# Altium schematic sheet 04_LMS7002M_Digital.SchDoc: LMS7002M #1 digital circuit
size A3; Organization: Lime Microsystems; Address1: Surrey Tech Centre; Address2: Guildford GU2 7YG; Address3: Surrey; Address4: United Kingdom; Revision: v1.2; SheetNumber: 4; SheetTotal: 27
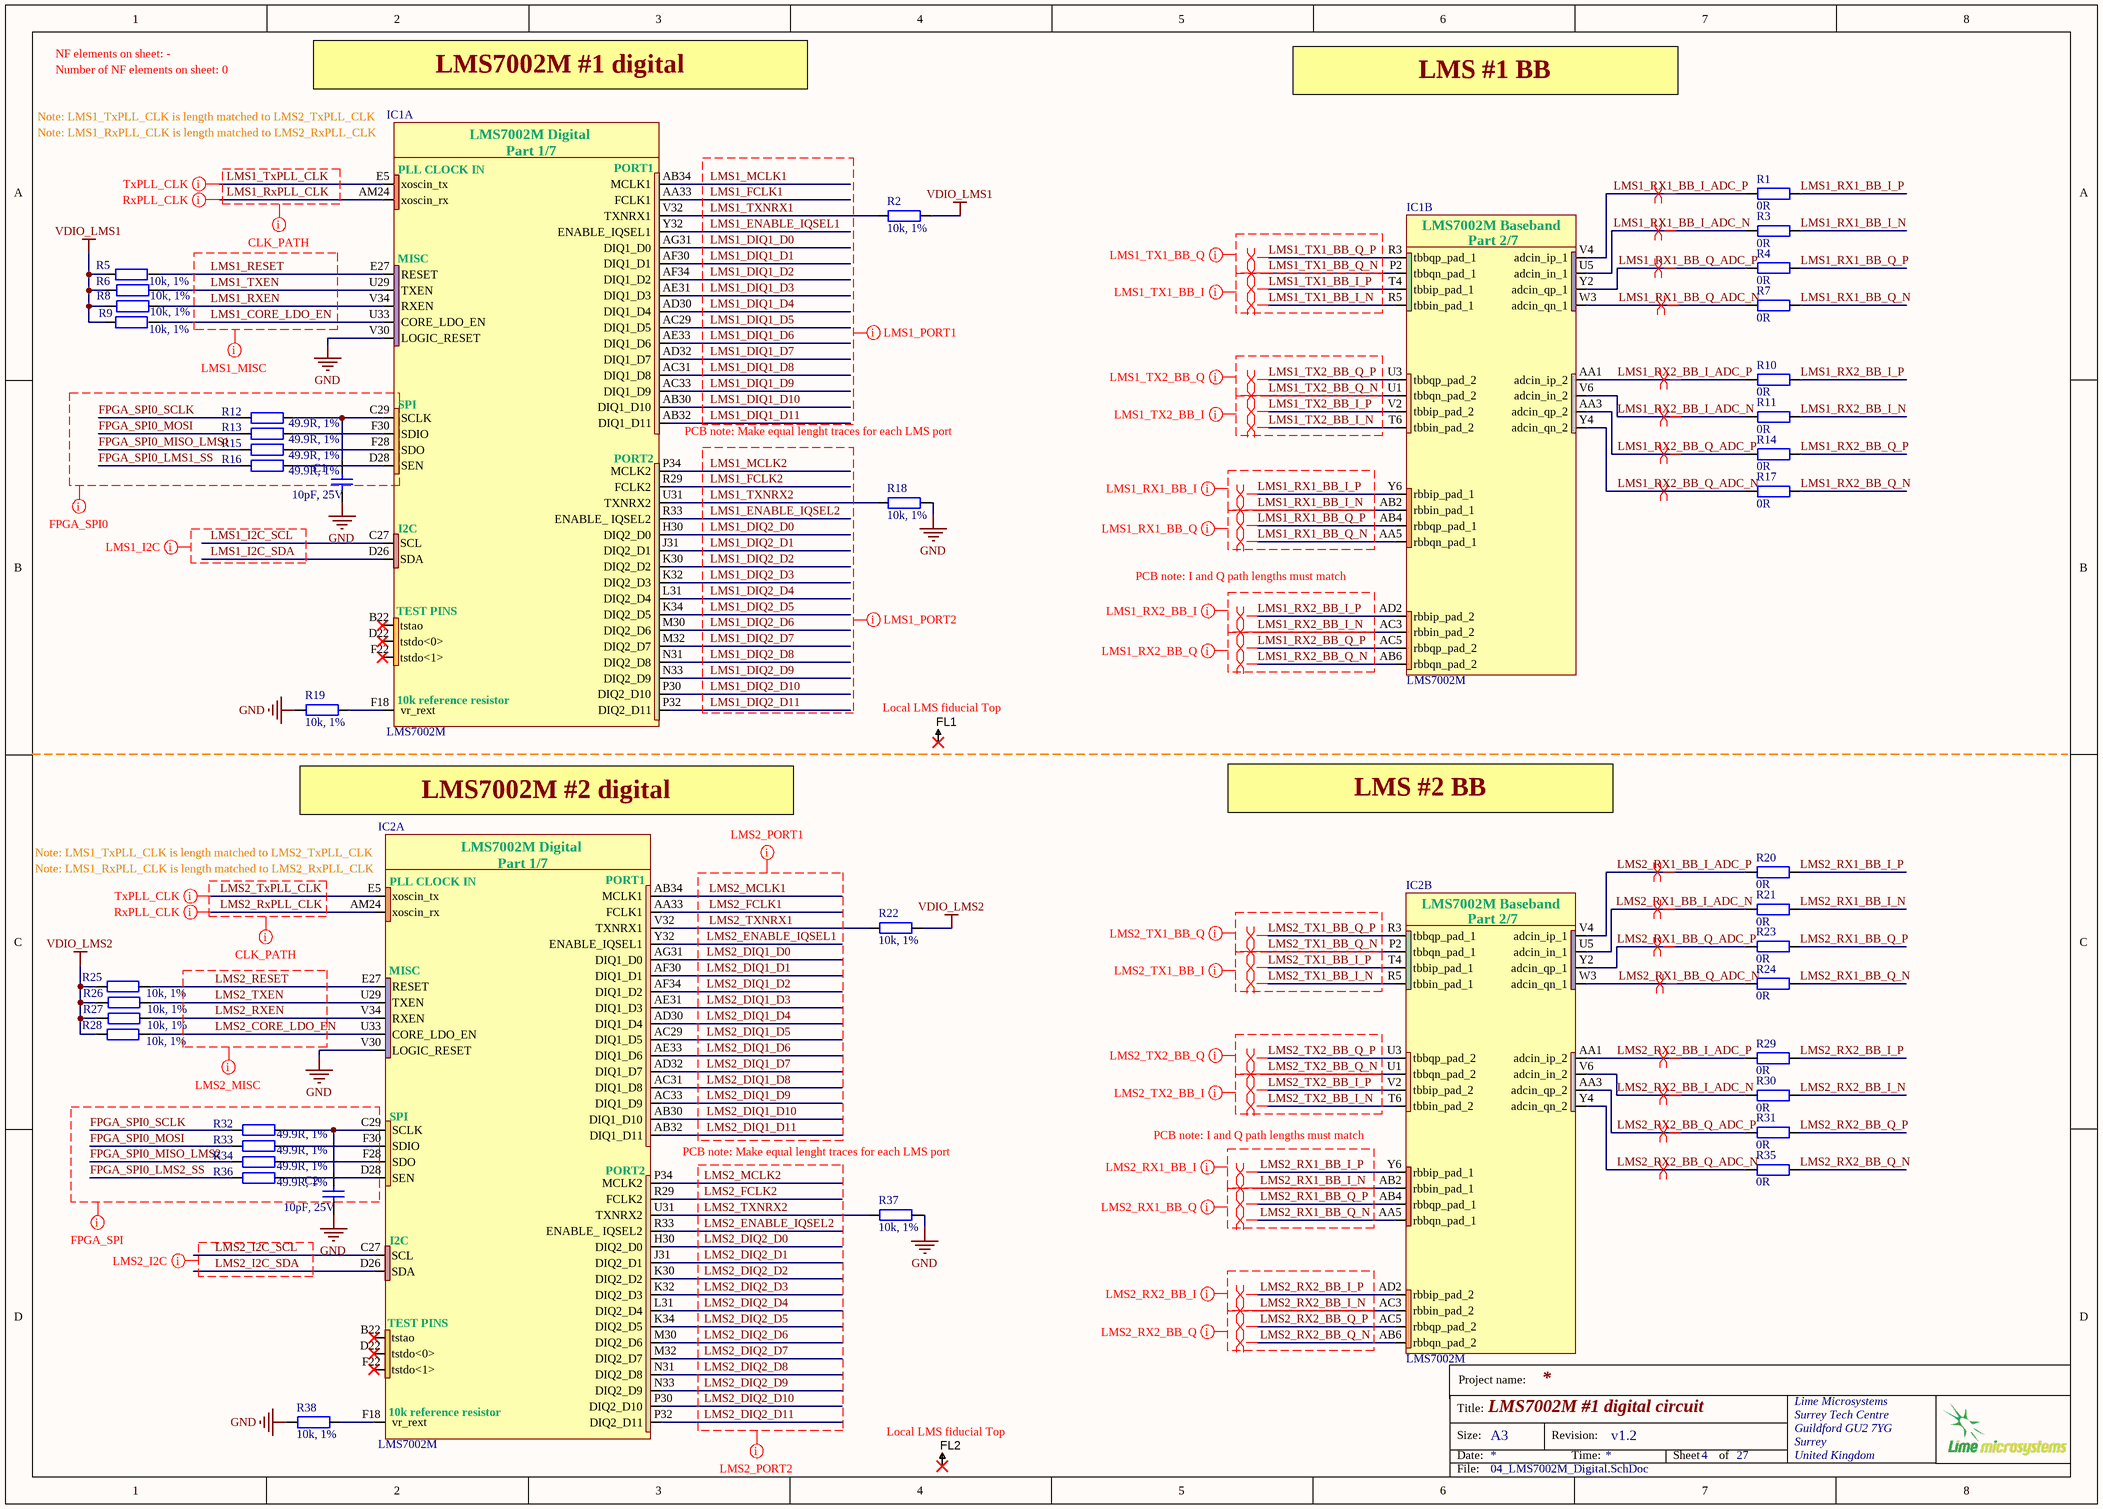
[diagram p0: 04_LMS7002M_Digital.SchDoc]

## Parts
C1  10pF, 25V  [CAP0402]
C2  10pF, 25V  [CAP0402]
FL1  Fiducial  [Fiducial_local]  (value not drawn)
FL2  Fiducial  [Fiducial_local]  (value not drawn)
IC1  LMS7002M  [LMS7002M_v4]  (parts A,B of 7)
IC2  LMS7002M  [LMS7002M_v4]  (parts A,B of 7)
R1  0R  [RES0402]
R2  10k, 1%  [RES0402]
R3  0R  [RES0402]
R4  0R  [RES0402]
R5  10k, 1%  [RES0402]
R6  10k, 1%  [RES0402]
R7  0R  [RES0402]
R8  10k, 1%  [RES0402]
R9  10k, 1%  [RES0402]
R10  0R  [RES0402]
R11  0R  [RES0402]
R12  49.9R, 1%  [RES0402]
R13  49.9R, 1%  [RES0402]
R14  0R  [RES0402]
R15  49.9R, 1%  [RES0402]
R16  49.9R, 1%  [RES0402]
R17  0R  [RES0402]
R18  10k, 1%  [RES0402]
R19  10k, 1%  [RES0402]
R20  0R  [RES0402]
R21  0R  [RES0402]
R22  10k, 1%  [RES0402]
R23  0R  [RES0402]
R24  0R  [RES0402]
R25  10k, 1%  [RES0402]
R26  10k, 1%  [RES0402]
R27  10k, 1%  [RES0402]
R28  10k, 1%  [RES0402]
R29  0R  [RES0402]
R30  0R  [RES0402]
R31  0R  [RES0402]
R32  49.9R, 1%  [RES0402]
R33  49.9R, 1%  [RES0402]
R34  49.9R, 1%  [RES0402]
R35  0R  [RES0402]
R36  49.9R, 1%  [RES0402]
R37  10k, 1%  [RES0402]
R38  10k, 1%  [RES0402]

## Nets
GND: C1.2 C2.2 IC1.V30(LOGIC_RESET) IC2.V30(LOGIC_RESET) R18.2 R19.2 R37.2 R38.2
VDIO_LMS1: R2.2 R5.1 R6.2 R8.2 R9.1
VDIO_LMS2: R22.2 R25.1 R26.2 R27.2 R28.1
FPGA_SPI0_LMS1_SS: R16.2
FPGA_SPI0_LMS2_SS: R36.2
FPGA_SPI0_MISO_LMS1: R15.2
FPGA_SPI0_MISO_LMS2: R34.2
FPGA_SPI0_MOSI: R13.2 R33.2
FPGA_SPI0_SCLK: R12.2 R32.2
LMS1_CORE_LDO_EN: IC1.U33(CORE_LDO_EN) R9.2
LMS1_DIQ1_D0: IC1.AG31(DIQ1_D0)
LMS1_DIQ1_D1: IC1.AF30(DIQ1_D1)
LMS1_DIQ1_D2: IC1.AF34(DIQ1_D2)
LMS1_DIQ1_D3: IC1.AE31(DIQ1_D3)
LMS1_DIQ1_D4: IC1.AD30(DIQ1_D4)
LMS1_DIQ1_D5: IC1.AC29(DIQ1_D5)
LMS1_DIQ1_D6: IC1.AE33(DIQ1_D6)
LMS1_DIQ1_D7: IC1.AD32(DIQ1_D7)
LMS1_DIQ1_D8: IC1.AC31(DIQ1_D8)
LMS1_DIQ1_D9: IC1.AC33(DIQ1_D9)
LMS1_DIQ1_D10: IC1.AB30(DIQ1_D10)
LMS1_DIQ1_D11: IC1.AB32(DIQ1_D11)
LMS1_DIQ2_D0: IC1.H30(DIQ2_D0)
LMS1_DIQ2_D1: IC1.J31(DIQ2_D1)
LMS1_DIQ2_D2: IC1.K30(DIQ2_D2)
LMS1_DIQ2_D3: IC1.K32(DIQ2_D3)
LMS1_DIQ2_D4: IC1.L31(DIQ2_D4)
LMS1_DIQ2_D5: IC1.K34(DIQ2_D5)
LMS1_DIQ2_D6: IC1.M30(DIQ2_D6)
LMS1_DIQ2_D7: IC1.M32(DIQ2_D7)
LMS1_DIQ2_D8: IC1.N31(DIQ2_D8)
LMS1_DIQ2_D9: IC1.N33(DIQ2_D9)
LMS1_DIQ2_D10: IC1.P30(DIQ2_D10)
LMS1_DIQ2_D11: IC1.P32(DIQ2_D11)
LMS1_ENABLE_IQSEL1: IC1.Y32(ENABLE_IQSEL1)
LMS1_ENABLE_IQSEL2: IC1.R33(ENABLE__IQSEL2)
LMS1_FCLK1: IC1.AA33(FCLK1)
LMS1_FCLK2: IC1.R29(FCLK2)
LMS1_I2C_SCL: IC1.C27(SCL)
LMS1_I2C_SDA: IC1.D26(SDA)
LMS1_MCLK1: IC1.AB34(MCLK1)
LMS1_MCLK2: IC1.P34(MCLK2)
LMS1_RESET: IC1.E27(RESET) R5.2
LMS1_RX1_BB_I_ADC_N: IC1.U5(adcin_in_1) R3.2
LMS1_RX1_BB_I_ADC_P: IC1.V4(adcin_ip_1) R1.2
LMS1_RX1_BB_I_N: IC1.AB2(rbbin_pad_1) R3.1
LMS1_RX1_BB_I_P: IC1.Y6(rbbip_pad_1) R1.1
LMS1_RX1_BB_Q_ADC_N: IC1.W3(adcin_qn_1) R7.2
LMS1_RX1_BB_Q_ADC_P: IC1.Y2(adcin_qp_1) R4.2
LMS1_RX1_BB_Q_N: IC1.AA5(rbbqn_pad_1) R7.1
LMS1_RX1_BB_Q_P: IC1.AB4(rbbqp_pad_1) R4.1
LMS1_RX2_BB_I_ADC_N: IC1.V6(adcin_in_2) R11.2
LMS1_RX2_BB_I_ADC_P: IC1.AA1(adcin_ip_2) R10.2
LMS1_RX2_BB_I_N: IC1.AC3(rbbin_pad_2) R11.1
LMS1_RX2_BB_I_P: IC1.AD2(rbbip_pad_2) R10.1
LMS1_RX2_BB_Q_ADC_N: IC1.Y4(adcin_qn_2) R17.2
LMS1_RX2_BB_Q_ADC_P: IC1.AA3(adcin_qp_2) R14.2
LMS1_RX2_BB_Q_N: IC1.AB6(rbbqn_pad_2) R17.1
LMS1_RX2_BB_Q_P: IC1.AC5(rbbqp_pad_2) R14.1
LMS1_RXEN: IC1.V34(RXEN) R6.1
LMS1_RxPLL_CLK: IC1.AM24(xoscin_rx)
LMS1_TX1_BB_I_N: IC1.R5(tbbin_pad_1)
LMS1_TX1_BB_I_P: IC1.T4(tbbip_pad_1)
LMS1_TX1_BB_Q_N: IC1.P2(tbbqn_pad_1)
LMS1_TX1_BB_Q_P: IC1.R3(tbbqp_pad_1)
LMS1_TX2_BB_I_N: IC1.T6(tbbin_pad_2)
LMS1_TX2_BB_I_P: IC1.V2(tbbip_pad_2)
LMS1_TX2_BB_Q_N: IC1.U1(tbbqn_pad_2)
LMS1_TX2_BB_Q_P: IC1.U3(tbbqp_pad_2)
LMS1_TXEN: IC1.U29(TXEN) R8.1
LMS1_TXNRX1: IC1.V32(TXNRX1) R2.1
LMS1_TXNRX2: IC1.U31(TXNRX2) R18.1
LMS1_TxPLL_CLK: IC1.E5(xoscin_tx)
LMS2_CORE_LDO_EN: IC2.U33(CORE_LDO_EN) R28.2
LMS2_DIQ1_D0: IC2.AG31(DIQ1_D0)
LMS2_DIQ1_D1: IC2.AF30(DIQ1_D1)
LMS2_DIQ1_D2: IC2.AF34(DIQ1_D2)
LMS2_DIQ1_D3: IC2.AE31(DIQ1_D3)
LMS2_DIQ1_D4: IC2.AD30(DIQ1_D4)
LMS2_DIQ1_D5: IC2.AC29(DIQ1_D5)
LMS2_DIQ1_D6: IC2.AE33(DIQ1_D6)
LMS2_DIQ1_D7: IC2.AD32(DIQ1_D7)
LMS2_DIQ1_D8: IC2.AC31(DIQ1_D8)
LMS2_DIQ1_D9: IC2.AC33(DIQ1_D9)
LMS2_DIQ1_D10: IC2.AB30(DIQ1_D10)
LMS2_DIQ1_D11: IC2.AB32(DIQ1_D11)
LMS2_DIQ2_D0: IC2.H30(DIQ2_D0)
LMS2_DIQ2_D1: IC2.J31(DIQ2_D1)
LMS2_DIQ2_D2: IC2.K30(DIQ2_D2)
LMS2_DIQ2_D3: IC2.K32(DIQ2_D3)
LMS2_DIQ2_D4: IC2.L31(DIQ2_D4)
LMS2_DIQ2_D5: IC2.K34(DIQ2_D5)
LMS2_DIQ2_D6: IC2.M30(DIQ2_D6)
LMS2_DIQ2_D7: IC2.M32(DIQ2_D7)
LMS2_DIQ2_D8: IC2.N31(DIQ2_D8)
LMS2_DIQ2_D9: IC2.N33(DIQ2_D9)
LMS2_DIQ2_D10: IC2.P30(DIQ2_D10)
LMS2_DIQ2_D11: IC2.P32(DIQ2_D11)
LMS2_ENABLE_IQSEL1: IC2.Y32(ENABLE_IQSEL1)
LMS2_ENABLE_IQSEL2: IC2.R33(ENABLE__IQSEL2)
LMS2_FCLK1: IC2.AA33(FCLK1)
LMS2_FCLK2: IC2.R29(FCLK2)
LMS2_I2C_SCL: IC2.C27(SCL)
LMS2_I2C_SDA: IC2.D26(SDA)
LMS2_MCLK1: IC2.AB34(MCLK1)
LMS2_MCLK2: IC2.P34(MCLK2)
LMS2_RESET: IC2.E27(RESET) R25.2
LMS2_RX1_BB_I_ADC_N: IC2.U5(adcin_in_1) R21.2
LMS2_RX1_BB_I_ADC_P: IC2.V4(adcin_ip_1) R20.2
LMS2_RX1_BB_I_N: IC2.AB2(rbbin_pad_1) R21.1
LMS2_RX1_BB_I_P: IC2.Y6(rbbip_pad_1) R20.1
LMS2_RX1_BB_Q_ADC_N: IC2.W3(adcin_qn_1) R24.2
LMS2_RX1_BB_Q_ADC_P: IC2.Y2(adcin_qp_1) R23.2
LMS2_RX1_BB_Q_N: IC2.AA5(rbbqn_pad_1) R24.1
LMS2_RX1_BB_Q_P: IC2.AB4(rbbqp_pad_1) R23.1
LMS2_RX2_BB_I_ADC_N: IC2.V6(adcin_in_2) R30.2
LMS2_RX2_BB_I_ADC_P: IC2.AA1(adcin_ip_2) R29.2
LMS2_RX2_BB_I_N: IC2.AC3(rbbin_pad_2) R30.1
LMS2_RX2_BB_I_P: IC2.AD2(rbbip_pad_2) R29.1
LMS2_RX2_BB_Q_ADC_N: IC2.Y4(adcin_qn_2) R35.2
LMS2_RX2_BB_Q_ADC_P: IC2.AA3(adcin_qp_2) R31.2
LMS2_RX2_BB_Q_N: IC2.AB6(rbbqn_pad_2) R35.1
LMS2_RX2_BB_Q_P: IC2.AC5(rbbqp_pad_2) R31.1
LMS2_RXEN: IC2.V34(RXEN) R27.1
LMS2_RxPLL_CLK: IC2.AM24(xoscin_rx)
LMS2_TX1_BB_I_N: IC2.R5(tbbin_pad_1)
LMS2_TX1_BB_I_P: IC2.T4(tbbip_pad_1)
LMS2_TX1_BB_Q_N: IC2.P2(tbbqn_pad_1)
LMS2_TX1_BB_Q_P: IC2.R3(tbbqp_pad_1)
LMS2_TX2_BB_I_N: IC2.T6(tbbin_pad_2)
LMS2_TX2_BB_I_P: IC2.V2(tbbip_pad_2)
LMS2_TX2_BB_Q_N: IC2.U1(tbbqn_pad_2)
LMS2_TX2_BB_Q_P: IC2.U3(tbbqp_pad_2)
LMS2_TXEN: IC2.U29(TXEN) R26.1
LMS2_TXNRX1: IC2.V32(TXNRX1) R22.1
LMS2_TXNRX2: IC2.U31(TXNRX2) R37.1
LMS2_TxPLL_CLK: IC2.E5(xoscin_tx)
NetC1_1: C1.1 IC1.C29(SCLK) R12.1
NetC2_1: C2.1 IC2.C29(SCLK) R32.1
NetIC1_D28: IC1.D28(SEN) R16.1
NetIC1_F18: IC1.F18(vr_rext) R19.1
NetIC1_F28: IC1.F28(SDO) R15.1
NetIC1_F30: IC1.F30(SDIO) R13.1
NetIC2_D28: IC2.D28(SEN) R36.1
NetIC2_F18: IC2.F18(vr_rext) R38.1
NetIC2_F28: IC2.F28(SDO) R34.1
NetIC2_F30: IC2.F30(SDIO) R33.1

Not connected (* = marked no-connect by the designer): FL1 1*; FL2 1*; IC1 B22(tstao)* D22(tstdo<0>)* F22(tstdo<1>)*; IC2 B22(tstao)* D22(tstdo<0>)* F22(tstdo<1>)*

## Layout directives
differential pair: LMS1_RX1_BB_I_ADC_N, LMS1_RX1_BB_I_ADC_P, LMS1_RX1_BB_I_N, LMS1_RX1_BB_I_P, LMS1_RX1_BB_Q_ADC_N, LMS1_RX1_BB_Q_ADC_P, LMS1_RX1_BB_Q_N, LMS1_RX1_BB_Q_P, LMS1_RX2_BB_I_ADC_N, LMS1_RX2_BB_I_ADC_P, LMS1_RX2_BB_I_N, LMS1_RX2_BB_I_P, LMS1_RX2_BB_Q_ADC_N, LMS1_RX2_BB_Q_ADC_P, LMS1_RX2_BB_Q_N, LMS1_RX2_BB_Q_P, LMS1_TX1_BB_I_N, LMS1_TX1_BB_I_P, LMS1_TX1_BB_Q_N, LMS1_TX1_BB_Q_P, LMS1_TX2_BB_I_N, LMS1_TX2_BB_I_P, LMS1_TX2_BB_Q_N, LMS1_TX2_BB_Q_P, LMS2_RX1_BB_I_ADC_N, LMS2_RX1_BB_I_ADC_P, LMS2_RX1_BB_I_N, LMS2_RX1_BB_I_P, LMS2_RX1_BB_Q_ADC_N, LMS2_RX1_BB_Q_ADC_P, LMS2_RX1_BB_Q_N, LMS2_RX1_BB_Q_P, LMS2_RX2_BB_I_ADC_N, LMS2_RX2_BB_I_ADC_P, LMS2_RX2_BB_I_N, LMS2_RX2_BB_I_P, LMS2_RX2_BB_Q_ADC_N, LMS2_RX2_BB_Q_ADC_P, LMS2_RX2_BB_Q_N, LMS2_RX2_BB_Q_P, LMS2_TX1_BB_I_N, LMS2_TX1_BB_I_P, LMS2_TX1_BB_Q_N, LMS2_TX1_BB_Q_P, LMS2_TX2_BB_I_N, LMS2_TX2_BB_I_P, LMS2_TX2_BB_Q_N, LMS2_TX2_BB_Q_P
net class LMS1_RX1_BB_I: LMS1_RX1_BB_I_N, LMS1_RX1_BB_I_P
net class LMS1_RX1_BB_Q: LMS1_RX1_BB_I_N, LMS1_RX1_BB_Q_N, LMS1_RX1_BB_Q_P
net class LMS1_TX1_BB_Q: LMS1_TX1_BB_Q_N, LMS1_TX1_BB_Q_P
net class LMS1_TX1_BB_I: LMS1_TX1_BB_I_N, LMS1_TX1_BB_I_P, LMS1_TX1_BB_Q_N
net class LMS1_TX2_BB_Q: LMS1_TX2_BB_Q_N, LMS1_TX2_BB_Q_P
net class LMS1_TX2_BB_I: LMS1_TX2_BB_I_N, LMS1_TX2_BB_I_P, LMS1_TX2_BB_Q_N
net class FPGA_SPI0: FPGA_SPI0_LMS1_SS, FPGA_SPI0_MISO_LMS1, FPGA_SPI0_MOSI, FPGA_SPI0_SCLK
net class LMS1_I2C: LMS1_I2C_SCL, LMS1_I2C_SDA
net class LMS1_PORT2: LMS1_DIQ2_D0, LMS1_DIQ2_D1, LMS1_DIQ2_D2, LMS1_DIQ2_D3, LMS1_DIQ2_D4, LMS1_DIQ2_D5, LMS1_DIQ2_D6, LMS1_DIQ2_D7, LMS1_DIQ2_D8, LMS1_DIQ2_D9, LMS1_DIQ2_D10, LMS1_DIQ2_D11, LMS1_ENABLE_IQSEL2, LMS1_FCLK2, LMS1_MCLK2, LMS1_TXNRX2
net class LMS1_PORT1: LMS1_DIQ1_D0, LMS1_DIQ1_D1, LMS1_DIQ1_D2, LMS1_DIQ1_D3, LMS1_DIQ1_D4, LMS1_DIQ1_D5, LMS1_DIQ1_D6, LMS1_DIQ1_D7, LMS1_DIQ1_D8, LMS1_DIQ1_D9, LMS1_DIQ1_D10, LMS1_DIQ1_D11, LMS1_ENABLE_IQSEL1, LMS1_FCLK1, LMS1_MCLK1, LMS1_TXNRX1
net class LMS1_MISC: LMS1_CORE_LDO_EN, LMS1_RESET, LMS1_RXEN, LMS1_TXEN
net class CLK_PATH: LMS1_RxPLL_CLK, LMS1_TxPLL_CLK, LMS2_RxPLL_CLK, LMS2_TxPLL_CLK
net class FPGA_SPI: FPGA_SPI0_LMS2_SS, FPGA_SPI0_MISO_LMS2, FPGA_SPI0_MOSI, FPGA_SPI0_SCLK
net class LMS2_I2C: LMS2_I2C_SCL, LMS2_I2C_SDA
net class LMS2_PORT2: LMS2_DIQ2_D0, LMS2_DIQ2_D1, LMS2_DIQ2_D2, LMS2_DIQ2_D3, LMS2_DIQ2_D4, LMS2_DIQ2_D5, LMS2_DIQ2_D6, LMS2_DIQ2_D7, LMS2_DIQ2_D8, LMS2_DIQ2_D9, LMS2_DIQ2_D10, LMS2_DIQ2_D11, LMS2_ENABLE_IQSEL2, LMS2_FCLK2, LMS2_MCLK2, LMS2_TXNRX2
net class LMS2_PORT1: LMS2_DIQ1_D0, LMS2_DIQ1_D1, LMS2_DIQ1_D2, LMS2_DIQ1_D3, LMS2_DIQ1_D4, LMS2_DIQ1_D5, LMS2_DIQ1_D6, LMS2_DIQ1_D7, LMS2_DIQ1_D8, LMS2_DIQ1_D9, LMS2_DIQ1_D10, LMS2_DIQ1_D11, LMS2_ENABLE_IQSEL1, LMS2_FCLK1, LMS2_MCLK1, LMS2_TXNRX1
net class LMS2_TX1_BB_Q: LMS2_TX1_BB_Q_N, LMS2_TX1_BB_Q_P
net class LMS2_TX1_BB_I: LMS2_TX1_BB_I_N, LMS2_TX1_BB_I_P, LMS2_TX1_BB_Q_N
net class LMS2_TX2_BB_Q: LMS2_TX2_BB_Q_N, LMS2_TX2_BB_Q_P
net class LMS2_TX2_BB_I: LMS2_TX2_BB_I_N, LMS2_TX2_BB_I_P, LMS2_TX2_BB_Q_N
net class LMS2_MISC: LMS2_CORE_LDO_EN, LMS2_RESET, LMS2_RXEN, LMS2_TXEN
net class LMS2_RX1_BB_I: LMS2_RX1_BB_I_N, LMS2_RX1_BB_I_P
net class LMS2_RX1_BB_Q: LMS2_RX1_BB_I_N, LMS2_RX1_BB_Q_N, LMS2_RX1_BB_Q_P
net class LMS2_RX2_BB_I: LMS2_RX2_BB_I_P
net class LMS2_RX2_BB_Q: LMS2_RX2_BB_I_N, LMS2_RX2_BB_Q_N, LMS2_RX2_BB_Q_P
net class LMS1_RX2_BB_I: LMS1_RX2_BB_I_N, LMS1_RX2_BB_I_P
net class LMS1_RX2_BB_Q: LMS1_RX2_BB_I_N, LMS1_RX2_BB_Q_N, LMS1_RX2_BB_Q_P
net class RxPLL_CLK: LMS1_RxPLL_CLK, LMS2_RxPLL_CLK
net class TxPLL_CLK: LMS1_TxPLL_CLK, LMS2_TxPLL_CLK

## Notes on the sheet
- NF elements on sheet: -
- Number of NF elements on sheet: 0
- LMS7002M #1 digital
- LMS #1 BB
- Note: LMS1_TxPLL_CLK is length matched to LMS2_TxPLL_CLK
- (near IC1) Note: LMS1_RxPLL_CLK is length matched to LMS2_RxPLL_CLK
- (near IC1) PCB note: Make equal lenght traces for each LMS port
- (near IC1) PCB note: I and Q path lengths must match
- (near FL1) Local LMS fiducial Top
- (near IC2) Note: LMS1_TxPLL_CLK is length matched to LMS2_TxPLL_CLK
- LMS7002M #2 digital
- LMS #2 BB
- (near IC2) Note: LMS1_RxPLL_CLK is length matched to LMS2_RxPLL_CLK
- (near IC2) PCB note: Make equal lenght traces for each LMS port
- (near IC2) PCB note: I and Q path lengths must match
- (near FL2) Local LMS fiducial Top
- Project name:
- Title:
- Size:
- Date:
- A3
- Revision:
- Time:
- Sheet
- of
- File:
- (in symbol LMS7002Mr3, part A) LMS7002M Digital; Part 1/7; PLL CLOCK IN; PORT1; MISC; SPI; PORT2; I2C; TEST PINS; 10k reference resistor
- (in symbol LMS7002Mr3, part B) LMS7002M Baseband; Part 2/7

## Library data of the parts
C1 C2 = Cap_0402: Manufacturer Part Number 1: 04023A100JAT2A; Manufacturer: AVX; Part Description: 10pF ±5% 25V Ceramic Capacitor C0G, NP0 0402 (1005 Metric); Capacitance Tolerance: ± 5%; Voltage Rating: 25; Ceramic Capacitor Case: 0402 [1005 Metric]; Capacitor Case Style: 0402 [1005 Metric]<!--FANDB--><div class="features-and-benefits-container"></div>; Dielectric Characteristic: C0G / NP0; SVHC: No SVHC (16-Jun-2014); Capacitance: 10; Value: 10pF, 25V; Supplier 1: Farnell; Supplier Part Number 1: 2332478RL; Product Range: -; RoHS: YES; Operating Temperature Min: -55; Operating Temperature Max: 125; Capacitance Tolerance ±: ± 5%; MSL: MSL 1 - Unlimited; Packaging: Cut Tape
IC1 IC2 = LMS7002Mr3: Schematic symbol revision 3. Default footprint - 0.31mm pad; Manufacturer: Lime Microsystems; Part Description: IC FPRF Transceiver LMS7002M; 261 pin aQFN; Supplier 1: Lime Microsystems; Supplier Part Number 1: LMS7002M; Manufacturer Part Number 1: LMS7002M
R1 R3 R4 R7 R10 R11 R14 R17 R20 R21 R23 R24 R29-R31 R35 = Res_0402: Manufacturer Part Number 1: RC0402JR-070RL; Manufacturer: Yageo; Part Description: RES SMD 0.0OHM JUMPER 1/16W 0402; Resistance (Ohms): 0.0; Tolerance: Jumper; Power (Watts): 0.063W, 1/16W; Value: 0R; Supplier 1: Digi-Key; Supplier Part Number 1: 311-0.0JRTR-ND; Category: Resistors; Temperature Coefficient: -; Features: Moisture Resistant; Supplier Device Package: 0402; Height: 0.016" (0.40mm); Package / Case: 0402 (1005 Metric); Operating Temperature: -55°C ~ 155°C; Size / Dimension: 0.039" L x 0.020" W (1.00mm x 0.50mm); Composition: Thick Film; Packaging: Tape & Reel (TR); Number of Terminations: 2; RoHS: RoHS Compliant
R2 R5 R6 R8 R9 R18 R19 R22 R25-R28 R37 R38 = Res_0402: Manufacturer: Yageo; Manufacturer Part Number 1: RC0402FR-0710KL; Part Description: RES SMD 10K OHM 1% 1/16W 0402; Temperature Coefficient: ±100ppm/°C; Power (Watts): 0.063W, 1/16W; Value: 10k, 1%; Supplier 1: Digi-Key; Supplier Part Number 1: 311-10.0KLRTR-ND; Resistance (Ohms): 10k; Packaging: Tape & Reel (TR); RoHS: RoHS Compliant; Package / Case: 0402 (1005 Metric); Tolerance: ±1%; Operating Temperature: -55°C ~ 155°C; Size / Dimension: 0.039" L x 0.020" W (1.00mm x 0.50mm); Number of Terminations: 2; Category: Resistors; Height: 0.016" (0.40mm); Supplier Device Package: 0402; Features: Moisture Resistant; Composition: Thick Film
R12 R13 R15 R16 R32-R34 R36 = Res_0402: Manufacturer: Samsung Electro-Mechanics America, Inc.; Part Description: RES SMD 49.9 OHM 1% 1/16W 0402; Manufacturer Part Number 1: RC1005F49R9CS; Temperature Coefficient: ±100ppm/°C; Resistance (Ohms): 49.9; Power (Watts): 0.063W, 1/16W; Number of Terminations: 2; Size / Dimension: 0.039" L x 0.020" W (1.00mm x 0.50mm); Supplier Device Package: 0402 (1005 Metric); RoHS: RoHS Compliant; Supplier Part Number 1: 1276-3469-6-ND; Features: -; Packaging: Digi-Reel®; Tolerance: ±1%; Height: 0.016" (0.40mm); Category: Resistors; Composition: Thick Film; Package / Case: 0402 (1005 Metric); Supplier 1: Digi-Key; Operating Temperature: -55°C ~ 155°C; Value: 49.9R, 1%